# Altium schematic sheet SVPX_protection.SchDoc: SVPXFMC Carrier 3U
size A4; CheckedBy: \; Author: G.Kasprowicz; CompanyName: ISE; DrawnBy: T.Przywozki; Organization: WUT ISE; Address1: Warsaw University of Technology; Address2: Nowowiejska 15/19 00-665 Warsaw; Revision: 1.0.; SheetNumber: 19; SheetTotal: 20; Project: SVPXFMC Carrier 3U; ModifiedBy: -; CheckedDate: -; Title2: SpaceVPX interface protection; DivGrp: ISE; Designer: G. Kasprowicz
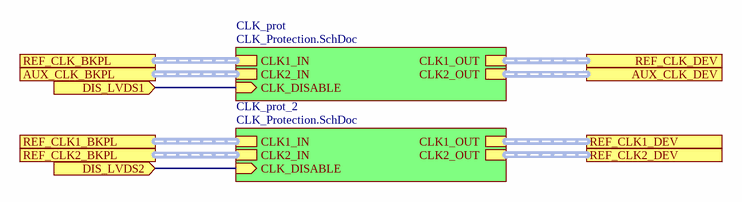
[diagram p0: SVPX_protection.SchDoc]

## Sub-sheets
CLK_prot = CLK_Protection.SchDoc: CLK_DISABLE (in), CLK1_IN (harness CLK), CLK2_IN (harness CLK), CLK2_OUT (harness CLK), CLK1_OUT (harness CLK)
CLK_prot_2 = CLK_Protection.SchDoc: CLK_DISABLE (in), CLK1_IN (harness CLK), CLK2_IN (harness CLK), CLK2_OUT (harness CLK), CLK1_OUT (harness CLK)

## Ports
AUX_CLK_BKPL (harness CLK), AUX_CLK_DEV (harness CLK), DIS_LVDS1 (in), DIS_LVDS2 (in), REF_CLK1_BKPL (harness CLK), REF_CLK1_DEV (harness CLK), REF_CLK2_BKPL (harness CLK), REF_CLK2_DEV (harness CLK), REF_CLK_BKPL (harness CLK), REF_CLK_DEV (harness CLK)

## Nets
DIS_LVDS1: port DIS_LVDS1, sheet CLK_prot/CLK_DISABLE
DIS_LVDS2: port DIS_LVDS2, sheet CLK_prot_2/CLK_DISABLE

## Buses and harness runs
harness port AUX_CLK_BKPL = sheet CLK_prot/CLK2_IN
harness port AUX_CLK_DEV = sheet CLK_prot/CLK2_OUT
harness port REF_CLK1_BKPL = sheet CLK_prot_2/CLK1_IN
harness port REF_CLK1_DEV = sheet CLK_prot_2/CLK1_OUT
harness port REF_CLK2_BKPL = sheet CLK_prot_2/CLK2_IN
harness port REF_CLK2_DEV = sheet CLK_prot_2/CLK2_OUT
harness port REF_CLK_BKPL = sheet CLK_prot/CLK1_IN
harness port REF_CLK_DEV = sheet CLK_prot/CLK1_OUT

## Notes on the sheet
- Project/Equipment
- Document
- Designer
- Drawn by
- Check.by
- Copyright WUT ISE 2019
  This documentation describes Open Hardware and is licensed under the CERN OHL v.1.1. You may redistribute and modify this documentation under the terms of the CERN OHL v1.1.
  (http://ohwr.org/CERNOHL). This documentation is dristributed WITHOUT ANY EXPRESS OR IMPLIED WARRANTY, INCLUDING OF MERCHANTABILITY, SATISFACTORY QUALITY AND FITNESS FOR A PARTICULAR PURPOSE. Please see the CERN OHL v.1.1 for applicable conditions
- File
- Last Mod.
- Print Date
- Sheet
- Size
- A4
- of
- Rev